# EAGLE schematic misc (EAGLE 6.5.0)
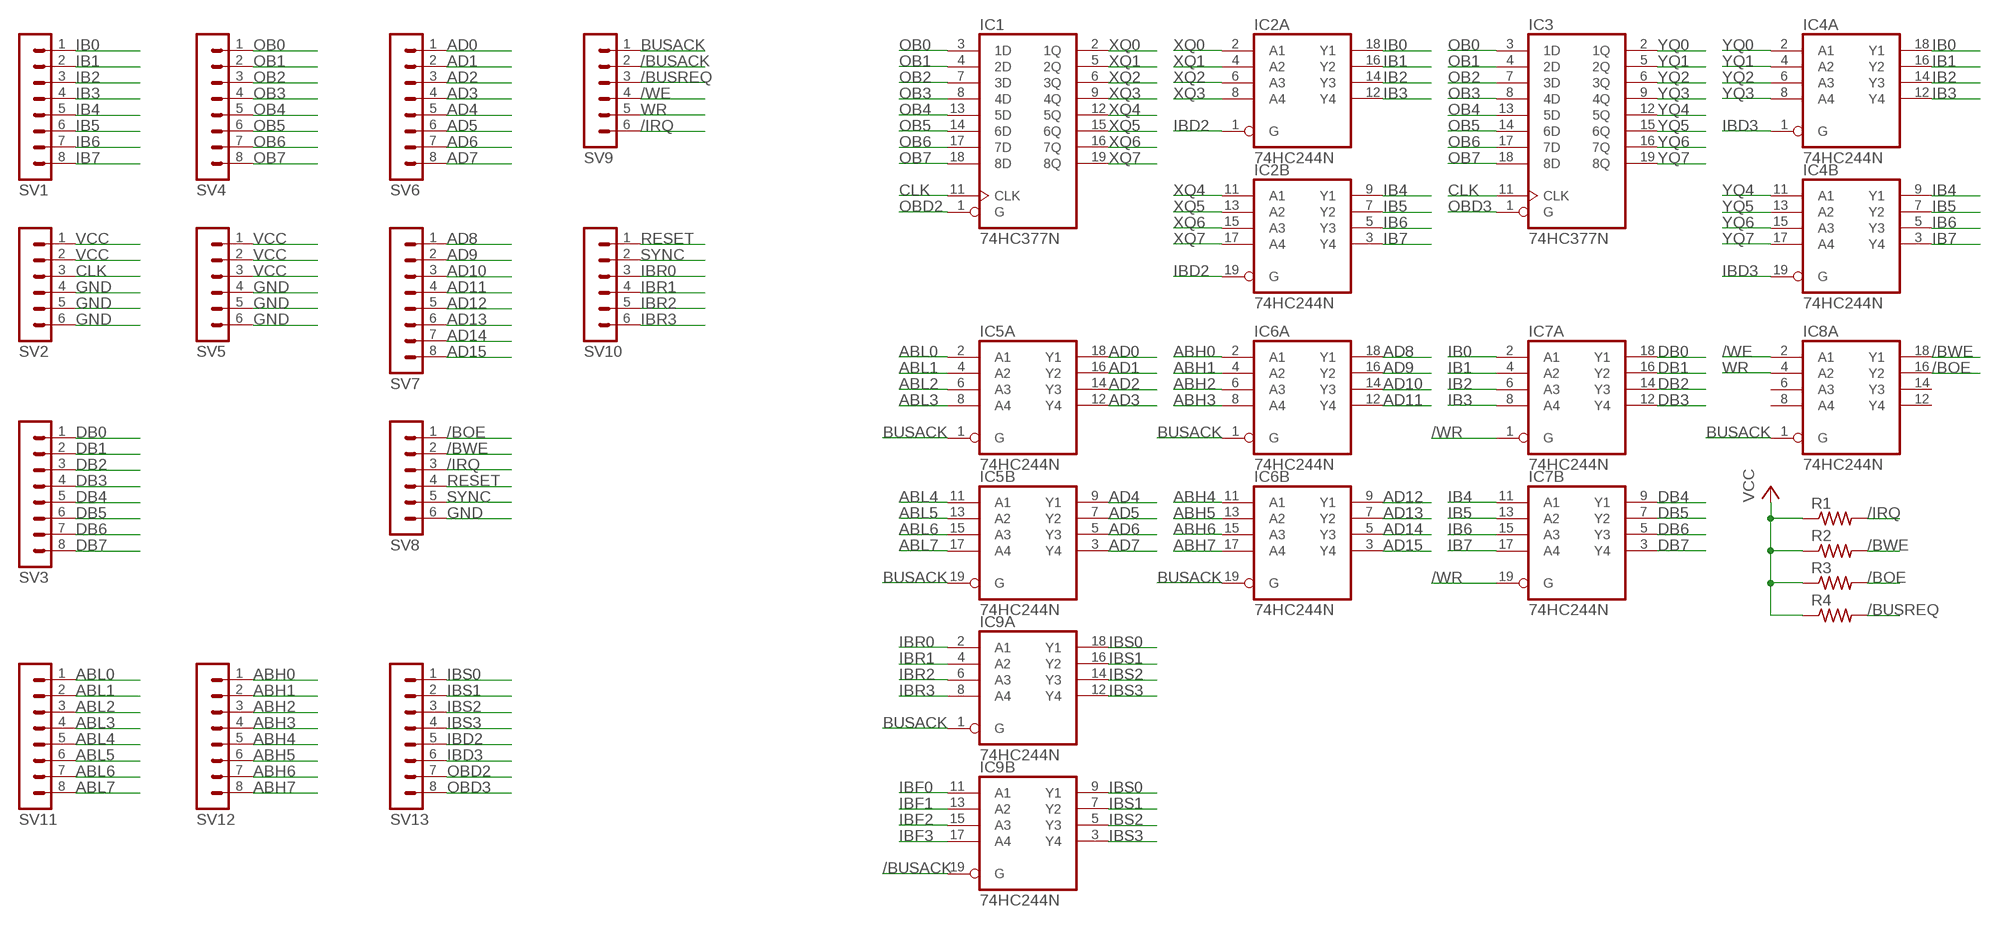
[diagram p0: schematic, sheet 1]

## Parts
IC1  74HC377N  [DIL20]
IC2  74HC244N  [DIL20]
IC3  74HC377N  [DIL20]
IC4  74HC244N  [DIL20]
IC5  74HC244N  [DIL20]
IC6  74HC244N  [DIL20]
IC7  74HC244N  [DIL20]
IC8  74HC244N  [DIL20]
IC9  74HC244N  [DIL20]
R1  R-US_0207/10  [0207/10]
R2  R-US_0207/10  [0207/10]
R3  R-US_0207/10  [0207/10]
R4  R-US_0207/10  [0207/10]
SV1  MA08-1  [MA08-1]
SV2  MA06-1  [MA06-1]
SV3  MA08-1  [MA08-1]
SV4  MA08-1  [MA08-1]
SV5  MA06-1  [MA06-1]
SV6  MA08-1  [MA08-1]
SV7  MA08-1  [MA08-1]
SV8  MA06-1  [MA06-1]
SV9  MA06-1  [MA06-1]
SV10  MA06-1  [MA06-1]
SV11  MA08-1  [MA08-1]
SV12  MA08-1  [MA08-1]
SV13  MA08-1  [MA08-1]

## Nets
/BOE: IC8.16(A:Y2) R3.2 SV8.1
/BUSACK: IC9.19(B:G) SV9.2
/BUSREQ: R4.2 SV9.3
/BWE: IC8.18(A:Y1) R2.2 SV8.2
/IRQ: R1.2 SV8.3 SV9.6
/WE: IC8.2(A:A1) SV9.4
/WR: IC7.1(A:G) IC7.19(B:G)
ABH0: IC6.2(A:A1) SV12.1
ABH1: IC6.4(A:A2) SV12.2
ABH2: IC6.6(A:A3) SV12.3
ABH3: IC6.8(A:A4) SV12.4
ABH4: IC6.11(B:A1) SV12.5
ABH5: IC6.13(B:A2) SV12.6
ABH6: IC6.15(B:A3) SV12.7
ABH7: IC6.17(B:A4) SV12.8
ABL0: IC5.2(A:A1) SV11.1
ABL1: IC5.4(A:A2) SV11.2
ABL2: IC5.6(A:A3) SV11.3
ABL3: IC5.8(A:A4) SV11.4
ABL4: IC5.11(B:A1) SV11.5
ABL5: IC5.13(B:A2) SV11.6
ABL6: IC5.15(B:A3) SV11.7
ABL7: IC5.17(B:A4) SV11.8
AD0: IC5.18(A:Y1) SV6.1
AD1: IC5.16(A:Y2) SV6.2
AD2: IC5.14(A:Y3) SV6.3
AD3: IC5.12(A:Y4) SV6.4
AD4: IC5.9(B:Y1) SV6.5
AD5: IC5.7(B:Y2) SV6.6
AD6: IC5.5(B:Y3) SV6.7
AD7: IC5.3(B:Y4) SV6.8
AD8: IC6.18(A:Y1) SV7.1
AD9: IC6.16(A:Y2) SV7.2
AD10: IC6.14(A:Y3) SV7.3
AD11: IC6.12(A:Y4) SV7.4
AD12: IC6.9(B:Y1) SV7.5
AD13: IC6.7(B:Y2) SV7.6
AD14: IC6.5(B:Y3) SV7.7
AD15: IC6.3(B:Y4) SV7.8
BUSACK: IC5.1(A:G) IC5.19(B:G) IC6.1(A:G) IC6.19(B:G) IC8.1(A:G) IC9.1(A:G) SV9.1
CLK: IC1.11(CLK) IC3.11(CLK) SV2.3
DB0: IC7.18(A:Y1) SV3.1
DB1: IC7.16(A:Y2) SV3.2
DB2: IC7.14(A:Y3) SV3.3
DB3: IC7.12(A:Y4) SV3.4
DB4: IC7.9(B:Y1) SV3.5
DB5: IC7.7(B:Y2) SV3.6
DB6: IC7.5(B:Y3) SV3.7
DB7: IC7.3(B:Y4) SV3.8
GND: SV2.4 SV2.5 SV2.6 SV5.4 SV5.5 SV5.6 SV8.6
IB0: IC2.18(A:Y1) IC4.18(A:Y1) IC7.2(A:A1) SV1.1
IB1: IC2.16(A:Y2) IC4.16(A:Y2) IC7.4(A:A2) SV1.2
IB2: IC2.14(A:Y3) IC4.14(A:Y3) IC7.6(A:A3) SV1.3
IB3: IC2.12(A:Y4) IC4.12(A:Y4) IC7.8(A:A4) SV1.4
IB4: IC2.9(B:Y1) IC4.9(B:Y1) IC7.11(B:A1) SV1.5
IB5: IC2.7(B:Y2) IC4.7(B:Y2) IC7.13(B:A2) SV1.6
IB6: IC2.5(B:Y3) IC4.5(B:Y3) IC7.15(B:A3) SV1.7
IB7: IC2.3(B:Y4) IC4.3(B:Y4) IC7.17(B:A4) SV1.8
IBD2: IC2.1(A:G) IC2.19(B:G) SV13.5
IBD3: IC4.1(A:G) IC4.19(B:G) SV13.6
IBF0: IC9.11(B:A1)
IBF1: IC9.13(B:A2)
IBF2: IC9.15(B:A3)
IBF3: IC9.17(B:A4)
IBR0: IC9.2(A:A1) SV10.3
IBR1: IC9.4(A:A2) SV10.4
IBR2: IC9.6(A:A3) SV10.5
IBR3: IC9.8(A:A4) SV10.6
IBS0: IC9.9(B:Y1) IC9.18(A:Y1) SV13.1
IBS1: IC9.7(B:Y2) IC9.16(A:Y2) SV13.2
IBS2: IC9.5(B:Y3) IC9.14(A:Y3) SV13.3
IBS3: IC9.3(B:Y4) IC9.12(A:Y4) SV13.4
OB0: IC1.3(1D) IC3.3(1D) SV4.1
OB1: IC1.4(2D) IC3.4(2D) SV4.2
OB2: IC1.7(3D) IC3.7(3D) SV4.3
OB3: IC1.8(4D) IC3.8(4D) SV4.4
OB4: IC1.13(5D) IC3.13(5D) SV4.5
OB5: IC1.14(6D) IC3.14(6D) SV4.6
OB6: IC1.17(7D) IC3.17(7D) SV4.7
OB7: IC1.18(8D) IC3.18(8D) SV4.8
OBD2: IC1.1(G) SV13.7
OBD3: IC3.1(G) SV13.8
RESET: SV8.4 SV10.1
SYNC: SV8.5 SV10.2
VCC: R1.1 R2.1 R3.1 R4.1 SV2.1 SV2.2 SV5.1 SV5.2 SV5.3
WR: IC8.4(A:A2) SV9.5
XQ0: IC1.2(1Q) IC2.2(A:A1)
XQ1: IC1.5(2Q) IC2.4(A:A2)
XQ2: IC1.6(3Q) IC2.6(A:A3)
XQ3: IC1.9(4Q) IC2.8(A:A4)
XQ4: IC1.12(5Q) IC2.11(B:A1)
XQ5: IC1.15(6Q) IC2.13(B:A2)
XQ6: IC1.16(7Q) IC2.15(B:A3)
XQ7: IC1.19(8Q) IC2.17(B:A4)
YQ0: IC3.2(1Q) IC4.2(A:A1)
YQ1: IC3.5(2Q) IC4.4(A:A2)
YQ2: IC3.6(3Q) IC4.6(A:A3)
YQ3: IC3.9(4Q) IC4.8(A:A4)
YQ4: IC3.12(5Q) IC4.11(B:A1)
YQ5: IC3.15(6Q) IC4.13(B:A2)
YQ6: IC3.16(7Q) IC4.15(B:A3)
YQ7: IC3.19(8Q) IC4.17(B:A4)
Unconnected: IC8.3(B:Y4) IC8.5(B:Y3) IC8.6(A:A3) IC8.7(B:Y2) IC8.8(A:A4) IC8.9(B:Y1) IC8.11(B:A1) IC8.12(A:Y4) IC8.13(B:A2) IC8.14(A:Y3) IC8.15(B:A3) IC8.17(B:A4) IC8.19(B:G)

## Power pins joined to a net without a drawn wire
GND: IC1.10(GND) IC2.10(P:GND) IC3.10(GND) IC4.10(P:GND) IC5.10(P:GND) IC6.10(P:GND) IC7.10(P:GND) IC8.10(P:GND) IC9.10(P:GND)
VCC: IC1.20(VCC) IC2.20(P:VCC) IC3.20(VCC) IC4.20(P:VCC) IC5.20(P:VCC) IC6.20(P:VCC) IC7.20(P:VCC) IC8.20(P:VCC) IC9.20(P:VCC)

## Library data of the parts
IC1 IC3 = 74xx-eu:74*377: Octal D type FLIP FLOP, enable
IC2 IC4-IC9 = 74xx-eu:74*244: Octal BUFFER and LINE DRIVER, 3-state
R1-R4 = rcl:R-US_: RESISTOR, American symbol
SV1 SV3 SV4 SV6 SV7 SV11-SV13 = con-lstb:MA08-1: PIN HEADER; OC_FARNELL: unknown; OC_NEWARK: unknown
SV2 SV5 SV8-SV10 = con-lstb:MA06-1: PIN HEADER; OC_FARNELL: unknown; OC_NEWARK: unknown